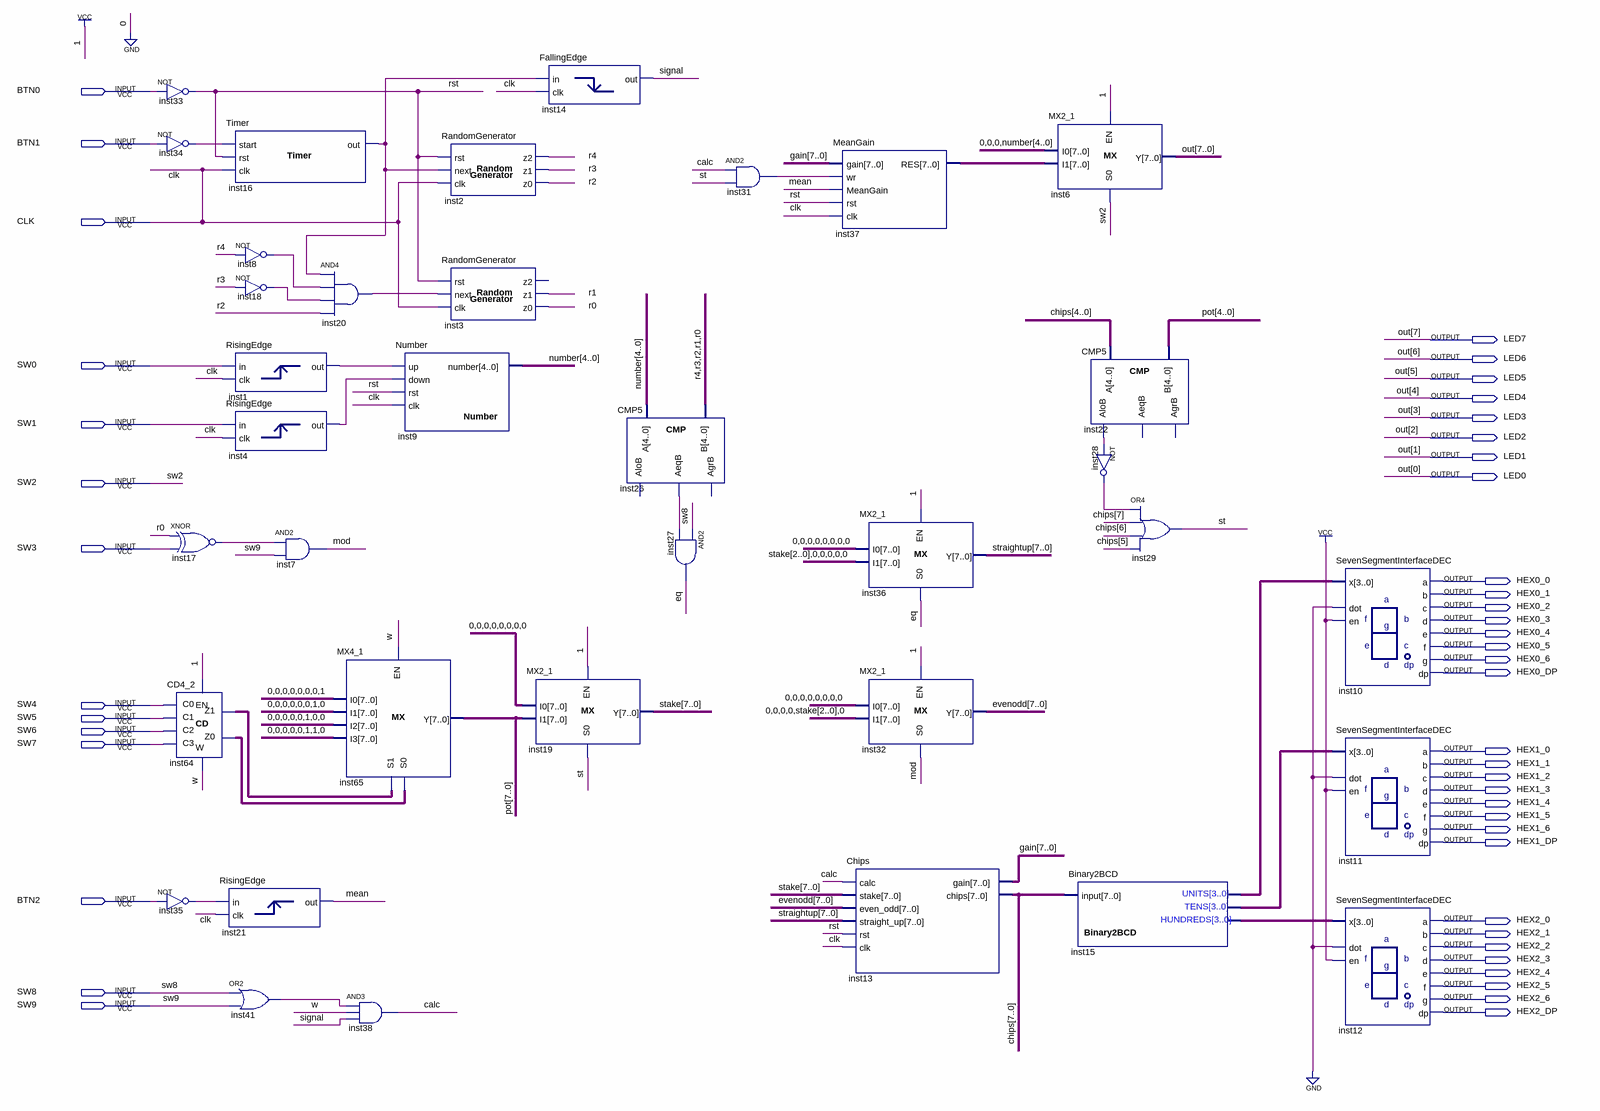
[diagram p0: schematic sheet]
// Quartus schematic PORT_LAB5.bdf as structural Verilog: 36 symbols, 46 pins
module PORT_LAB5 (
  input  BTN0,
  input  BTN1,
  input  CLK,
  input  SW0,
  input  SW1,
  input  SW2,
  input  SW3,
  input  SW4,
  input  SW5,
  input  SW6,
  input  SW7,
  input  BTN2,
  input  SW8,
  input  SW9,
  output LED7,
  output LED6,
  output LED5,
  output LED4,
  output LED3,
  output LED2,
  output LED1,
  output LED0,
  output HEX0_0,
  output HEX0_1,
  output HEX0_2,
  output HEX0_3,
  output HEX0_4,
  output HEX0_5,
  output HEX0_6,
  output HEX0_DP,
  output HEX1_0,
  output HEX1_1,
  output HEX1_2,
  output HEX1_3,
  output HEX1_4,
  output HEX1_5,
  output HEX1_6,
  output HEX1_DP,
  output HEX2_0,
  output HEX2_1,
  output HEX2_2,
  output HEX2_3,
  output HEX2_4,
  output HEX2_5,
  output HEX2_6,
  output HEX2_DP
);

  wire calc, eq, inst1_output, inst4_output, inst8_out, inst16_out, inst17_out, inst18_out, inst20_out,
       inst22_alob, inst26_aeqb, inst28_out, inst31_out, inst34_out, inst35_out, inst41_out, inst64_z0,
       inst64_z1, mean, mod, r0, r1, r2, r3, r4, rst, signal, st, w;
  wire [3:0] inst15_bcd_hundreds, inst15_bcd_tens, inst15_bcd_units;
  wire [4:0] number;
  wire [7:0] chips, evenodd, gain, inst37_res, pot, stake, straightup;

  not inst33 (rst, BTN0);
  not inst34 (inst34_out, BTN1);
  xnor inst17 (inst17_out, r0, SW3);
  CD4_2 inst64 (.C0(SW4), .C1(SW5), .C2(SW6), .C3(SW7), .EN(1'b1), .Z0(inst64_z0), .Z1(inst64_z1), .W(w));
  not inst35 (inst35_out, BTN2);
  Timer inst16 (.start(inst34_out), .rst(rst), .clk(CLK), .out(inst16_out));
  RisingEdge inst1 (.clk(CLK), .\input (SW0), .\output (inst1_output));
  RisingEdge inst4 (.clk(CLK), .\input (SW1), .\output (inst4_output));
  RisingEdge inst21 (.clk(CLK), .\input (inst35_out), .\output (mean));
  not inst8 (inst8_out, r4);
  not inst18 (inst18_out, r3);
  and inst7 (mod, inst17_out, SW9);
  or inst41 (inst41_out, SW8, SW9);
  and inst20 (inst20_out, inst16_out, inst8_out, inst18_out, r2);
  MX4_1 inst65 (
    .I3(8'b00000110), .I2(8'b00000100), .I1(8'b00000010), .I0(8'b00000001), .S1(inst64_z1), .S0(inst64_z0),
    .EN(w), .Y(pot));
  and inst38 (calc, inst41_out, w, signal);
  Number inst9 (.up(inst1_output), .down(inst4_output), .rst(rst), .clk(CLK), .number(number));
  RandomGenerator inst2 (.NXT(inst16_out), .RST(rst), .CLK(CLK), .Z2(r4), .Z1(r3), .Z0(r2));
  RandomGenerator inst3 (.NXT(inst20_out), .RST(rst), .CLK(CLK), .Z1(r1), .Z0(r0));  // open: Z2
  FallingEdge inst14 (.clk(CLK), .\input (inst16_out), .\output (signal));
  MX2_1 inst19 (.I1(pot), .I0({8{1'b0}}), .S0(st), .EN(1'b1), .Y(stake));
  CMP5 inst26 (.A(number), .B({r4, r3, r2, r1, r0}), .AeqB(inst26_aeqb));  // open: AgrB, AloB
  and inst27 (eq, SW8, inst26_aeqb);
  and inst31 (inst31_out, calc, st);
  MeanGain inst37 (.gain(gain), .wr(inst31_out), .MeanGain(mean), .rst(rst), .clk(CLK), .RES(inst37_res));
  Chips inst13 (
    .calc(calc), .stake(stake), .even_odd(evenodd), .straight_up(straightup), .rst(rst), .clk(CLK),
    .gain(gain), .chips(chips));
  MX2_1 inst36 (.I1({stake[2:0], {5{1'b0}}}), .I0({8{1'b0}}), .S0(eq), .EN(1'b1), .Y(straightup));
  MX2_1 inst32 (.I1({4'b0000, stake[2:0], 1'b0}), .I0({8{1'b0}}), .S0(mod), .EN(1'b1), .Y(evenodd));
  MX2_1 inst6 (
    .I1(inst37_res), .I0({3'b000, number}), .S0(SW2), .EN(1'b1),
    .Y({LED7, LED6, LED5, LED4, LED3, LED2, LED1, LED0}));
  CMP5 inst22 (.A(chips[4:0]), .B(pot[4:0]), .AloB(inst22_alob));  // open: AgrB, AeqB
  not inst28 (inst28_out, inst22_alob);
  Binary2BCD inst15 (
    .\input (chips), .bcd_hundreds(inst15_bcd_hundreds), .bcd_tens(inst15_bcd_tens),
    .bcd_units(inst15_bcd_units));
  or inst29 (st, inst28_out, chips[7], chips[6], chips[5]);
  SevenSegmentInterfaceDEC inst10 (
    .dot(1'b0), .en(1'b1), .x(inst15_bcd_units), .a(HEX0_0), .b(HEX0_1), .c(HEX0_2), .d(HEX0_3), .e(HEX0_4),
    .f(HEX0_5), .g(HEX0_6), .dp(HEX0_DP));
  SevenSegmentInterfaceDEC inst11 (
    .dot(1'b0), .en(1'b1), .x(inst15_bcd_tens), .a(HEX1_0), .b(HEX1_1), .c(HEX1_2), .d(HEX1_3), .e(HEX1_4),
    .f(HEX1_5), .g(HEX1_6), .dp(HEX1_DP));
  SevenSegmentInterfaceDEC inst12 (
    .dot(1'b0), .en(1'b1), .x(inst15_bcd_hundreds), .a(HEX2_0), .b(HEX2_1), .c(HEX2_2), .d(HEX2_3),
    .e(HEX2_4), .f(HEX2_5), .g(HEX2_6), .dp(HEX2_DP));

  // Other names for the same wires on the sheet: out[7:0] = {LED7, LED6, LED5, LED4, LED3, LED2, LED1, LED0}
endmodule
